# EasyEDA Pro project ProPrj_VEX_Competition_Switch_Solo_2025-08-26.epro

# Schematic VEX_Competition_Switch
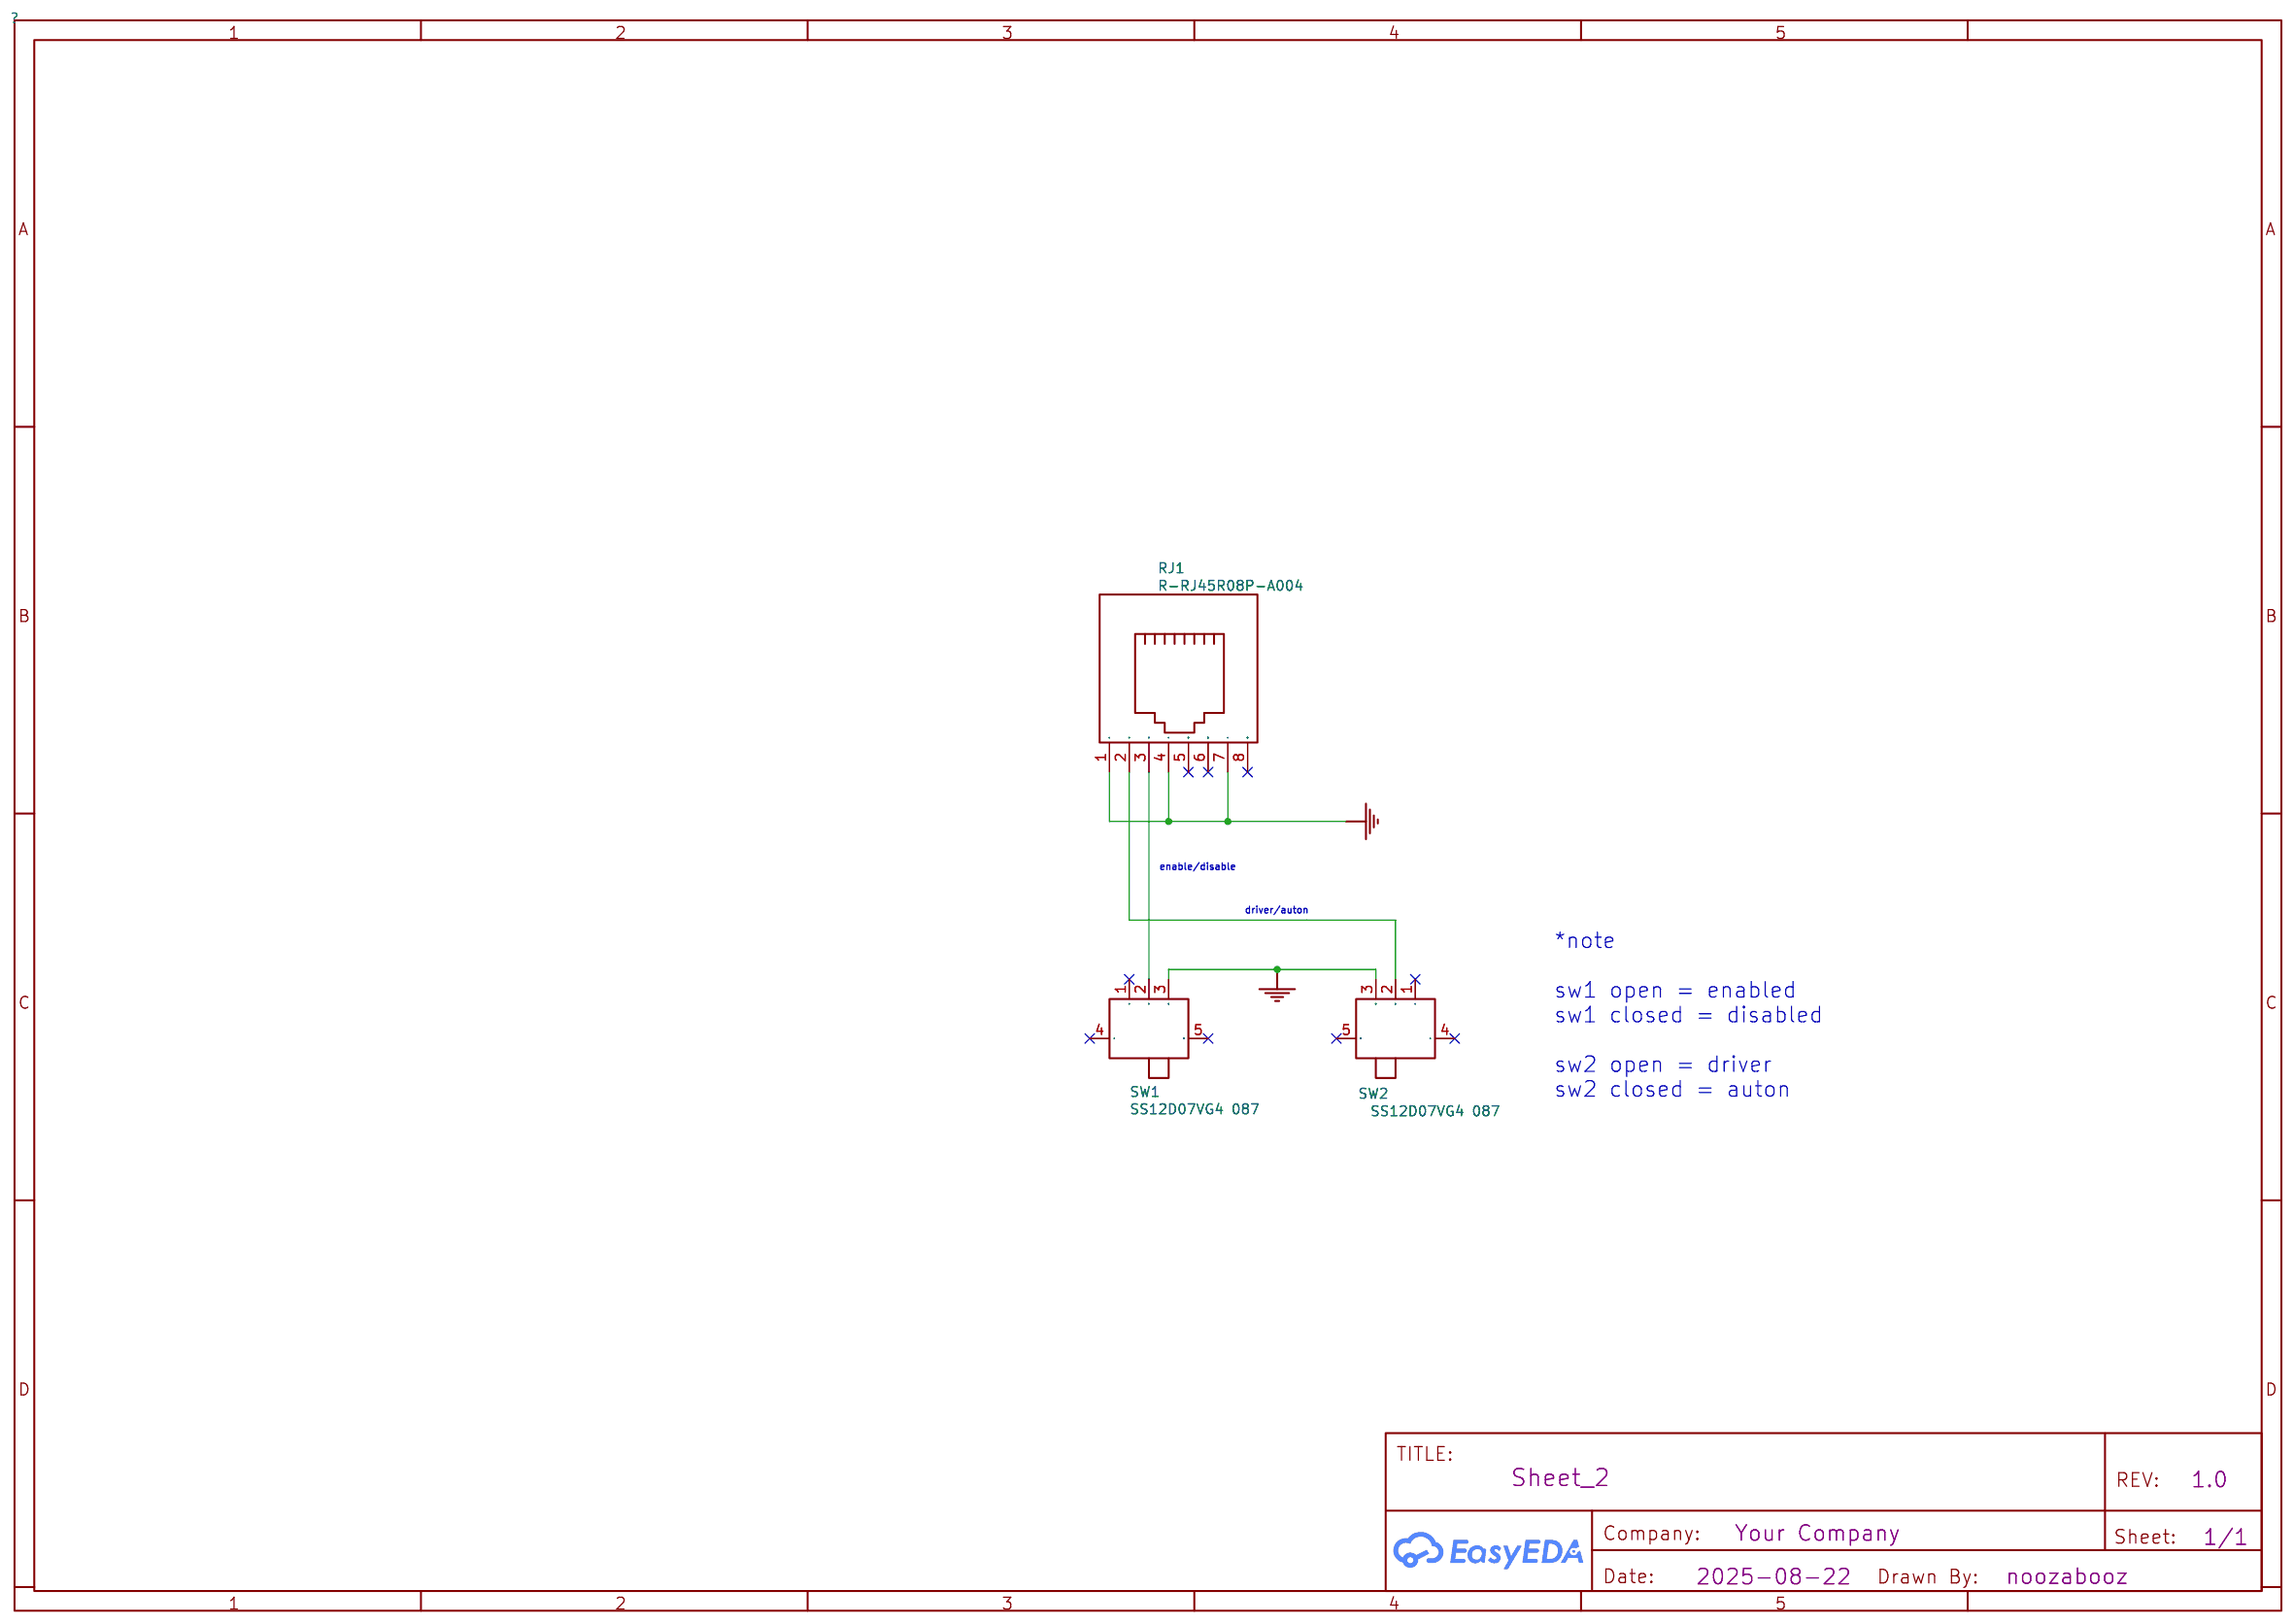
[diagram p0: schematic sheet]

## Parts
RJ1  R-RJ45R08P-A004  [RJ45-TH_R-RJ45R08P-A004]
SW1  SS12D07VG4 087  [SW-TH_SS12D07VG4]
SW2  SS12D07VG4 087  [SW-TH_SS12D07VG4]

## Library data of the parts
RJ1 = R-RJ45R08P-A004: Supplier: LCSC; Supplier Part: C385834; Manufacturer: Ckmtw(灿科盟); JLCPCB Part Class: Extended Part; Contributor: LCSC; spicePre: R
SW1 SW2 = SS12D07VG4 087: Supplier: LCSC; Supplier Part: C2939726; Manufacturer: SHOU HAN(首韩); JLCPCB Part Class: Extended Part; Contributor: LCSC; spicePre: S

## Nets
GND: RJ1.1 RJ1.4 RJ1.7 SW1.3 SW2.3
Net-(RJ1-3): RJ1.3 SW1.2
SW2_2: RJ1.2 SW2.2

Not connected (* = marked no-connect by the designer): RJ1 5* 6* 8*; SW1 1* 4* 5*; SW2 1* 4* 5*

## Notes on the sheet
- enable/disable
- driver/auton
- *note
  sw1 open = enabled
  sw1 closed = disabled
  sw2 open = driver
  sw2 closed = auton

# Board v1_PCB
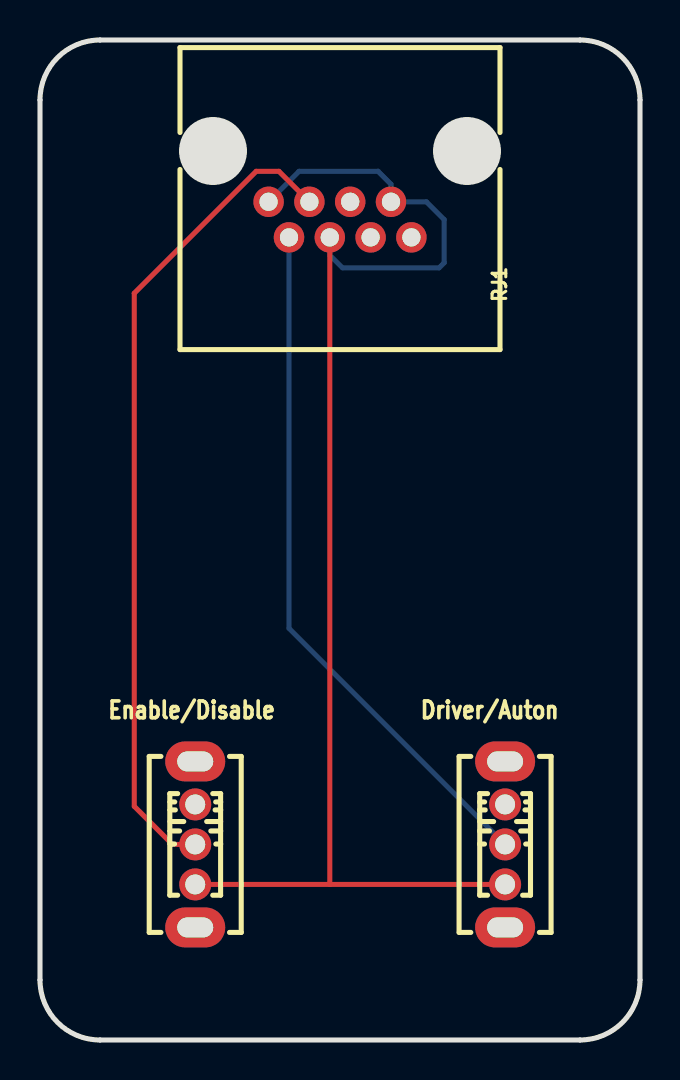
[diagram p1: board, top side]
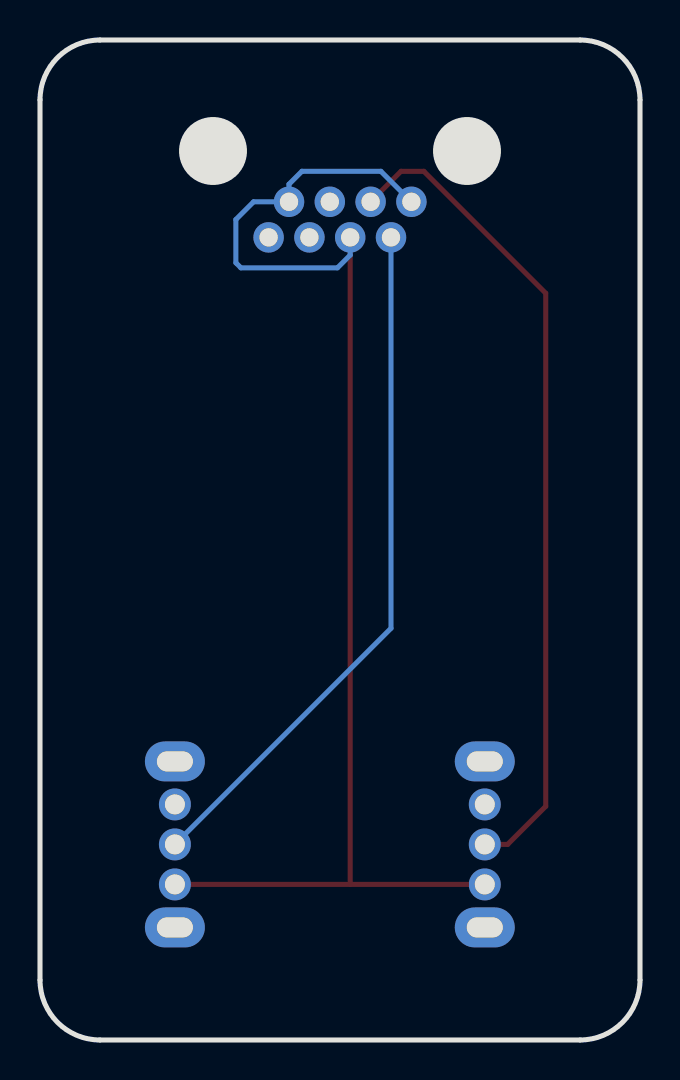
[diagram p2: board, bottom side, seen from below]

Outline 30 x 50 mm; copper layers: Top Layer, Bottom Layer. Coordinates in mm from the lower left corner of the outline.
Outline path: 0,47 arc(0.88,49.12) 3,50 27,50 arc(29.12,49.12) 30,47 30,3 arc(29.12,0.88) 27,0 3,0 arc(0.88,0.88) 0,3 0,47
Stack: Top Layer 0.035mm / Dielectric1 1.51mm FR4 er 4.5 / Bottom Layer 0.035mm

## Design rules (mm)
spacing Default (default): track to track 0.152, other pairs 0 to 0.152
track width Default (default): min 0.254, default 0.254, max 25.4
differential pair differentialPair (default): width min 0.127, default 0.254, max 2.54; gap min 0.152, default 0.152
via Default (default): diameter min 0.61, default 0.61, max 100.025; hole min 0.305, default 0.305, max 59.995

## Placement (name value [footprint] x y rotation side)
ENABLE/DISABLE  SS12D07VG4 087  [SW-TH_SS12D07VG4]  7.76 9.78 270 top
RJ1  R-RJ45R08P-A004  [RJ45-TH_R-RJ45R08P-A004]  15 41.02 180 top
SW2  SS12D07VG4 087  [SW-TH_SS12D07VG4]  23.25 9.78 270 top

## Footprints (pads in the part's own frame, mm; a bottom-side part is the same pattern mirrored in y, then rotated)
RJ45-TH_R-RJ45R08P-A004
  round 1.524 hole 0.914: 1(3.57,-0.89) 2(2.55,0.89) 3(1.53,-0.89) 4(0.51,0.89) 5(-0.51,-0.89) 6(-1.53,0.89) 7(-2.55,-0.89) 8(-3.57,0.89)
SW-TH_SS12D07VG4
  oval 1.6x1.6 hole 1: 1(-2,0) 2(0,0) 3(2,0)
  oval 2x3 hole 1x1.8: 4(4.15,0) 5(-4.15,0)

## Nets
GND: ENABLE/DISABLE.3 RJ1.1 RJ1.4 RJ1.7 SW2.3
SW1_2: ENABLE/DISABLE.2 RJ1.3
SW2_2: RJ1.2 SW2.2

Pads without a net: ENABLE/DISABLE 1 4 5; RJ1 5 6 8; SW2 1 4 5

## Routing (per net, layer and track width the routed paths; a pad name or vN(x,y) marks a point on that pad's centre or on a via; arc(x,y) is an arc through that point)
GND: length 67.9
  Top Layer w0.254: ENABLE/DISABLE.3 SW2.3 ; RJ1.4 14.49,7.78
  Bottom Layer w0.254: RJ1.4 14.49,39.25 15.13,38.61 19.95,38.61 20.21,38.86 20.21,41.02 19.32,41.91 RJ1.7 17.55,42.79 16.91,43.43 12.95,43.43 RJ1.1
SW1_2: length 41.4
  Top Layer w0.254: ENABLE/DISABLE.2 6.62,9.78 4.71,11.68 4.71,37.34 10.81,43.43 11.95,43.43 RJ1.3
SW2_2: length 34.8
  Bottom Layer w0.254: RJ1.2 12.45,20.58 SW2.2

## Text on the board
Top Solder Mask Layer: @NoozAbooz | Team 210K
Top Silkscreen Layer: Enable/Disable | Driver/Auton
